# EAGLE design elosztó (EAGLE 6.5.0)
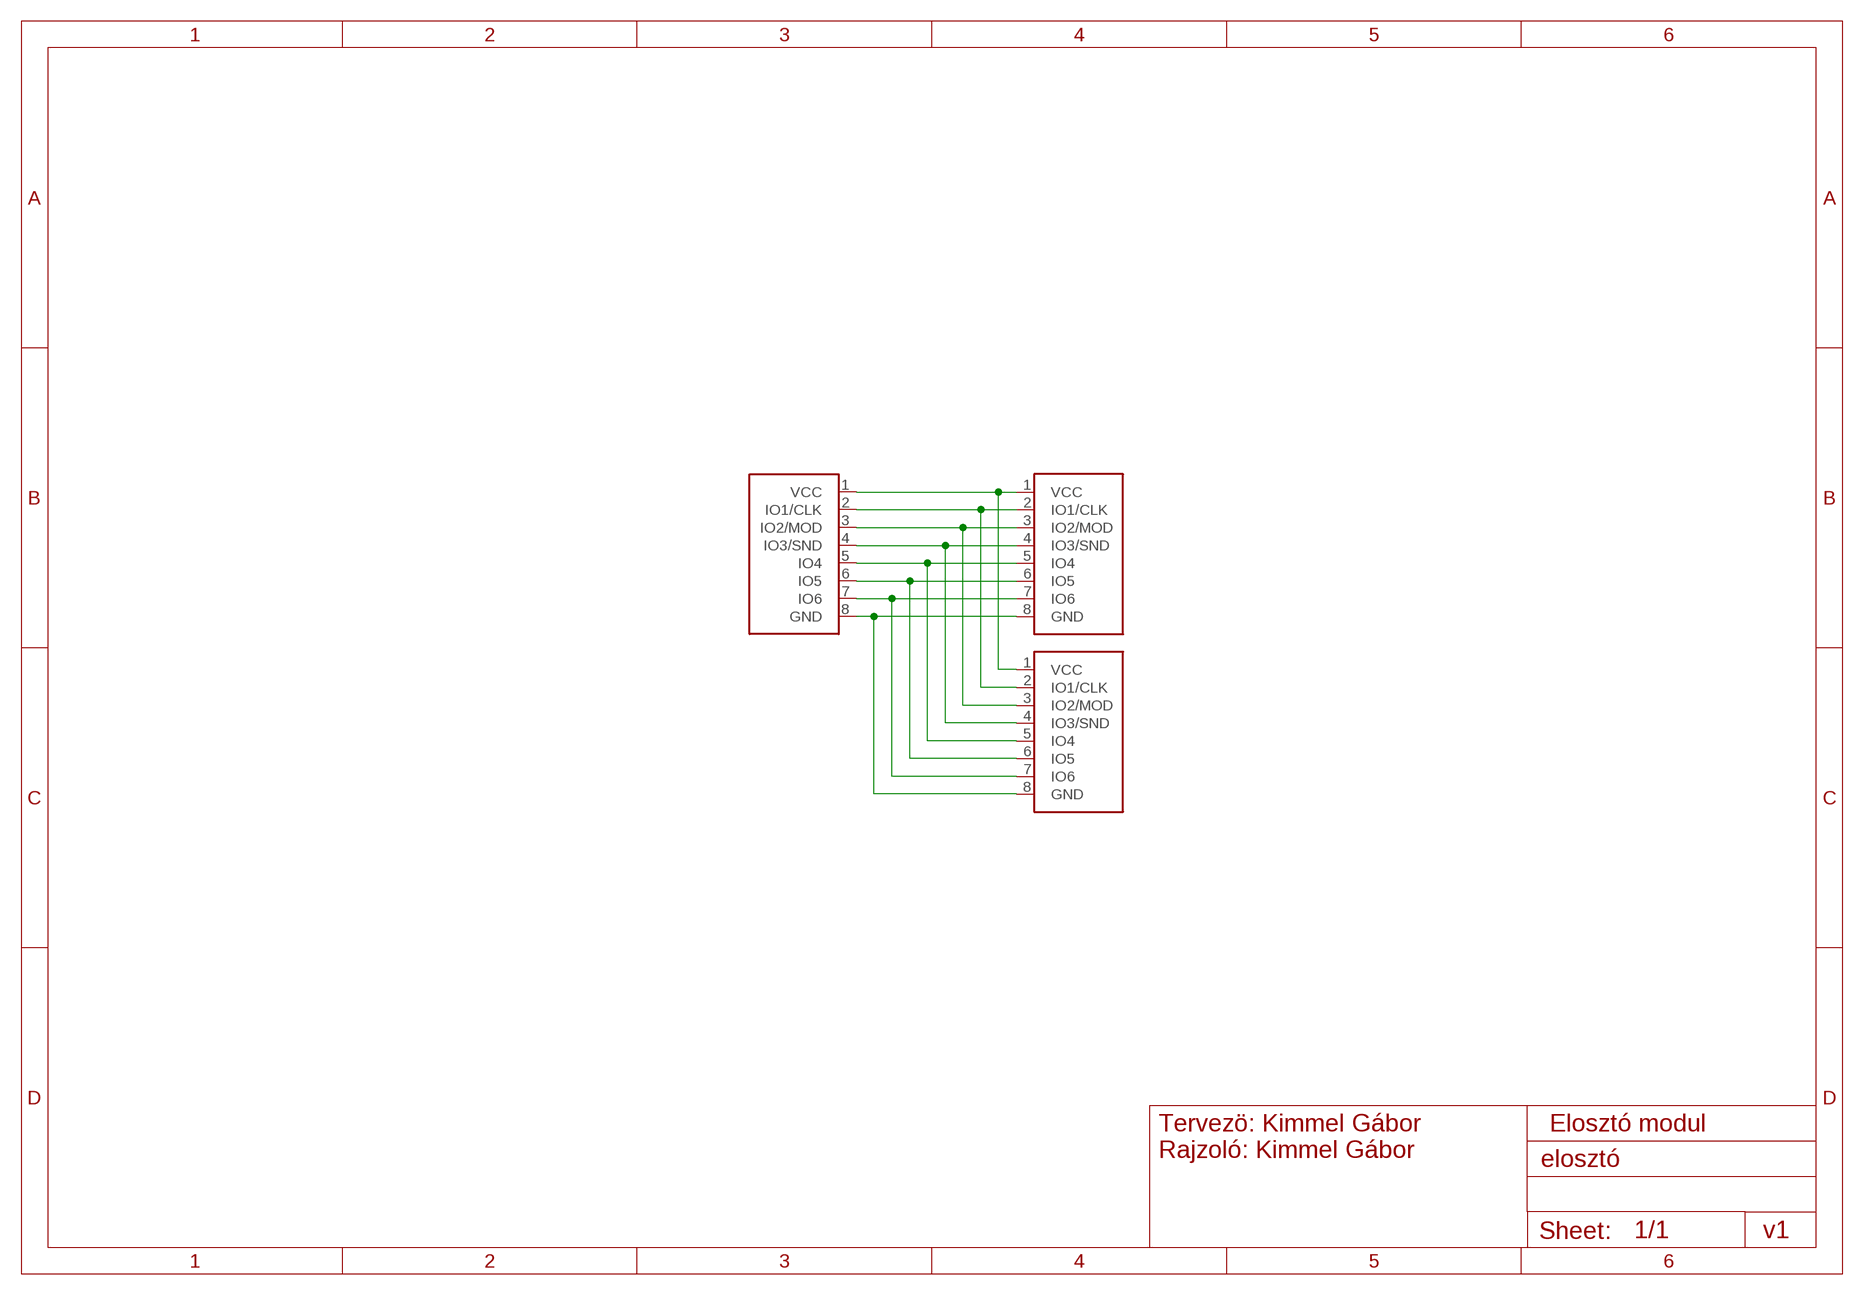
[diagram p0: schematic, sheet 1]

## Parts
U$1  GANZ-CONNECTOR  [FE08W]
U$2  GANZ-CONNECTOR-OUT  [MA08-1W]
U$3  GANZ-CONNECTOR-OUT  [MA08-1W]

## Nets
N$1: U$1.1(VCC) U$2.1(VCC) U$3.1(VCC)
N$2: U$1.2(IO1/CLK) U$2.2(IO1/CLK) U$3.2(IO1/CLK)
N$3: U$1.3(IO2/MOD) U$2.3(IO2/MOD) U$3.3(IO2/MOD)
N$4: U$1.4(IO3/SND) U$2.4(IO3/SND) U$3.4(IO3/SND)
N$5: U$1.5(IO4) U$2.5(IO4) U$3.5(IO4)
N$6: U$1.6(IO5) U$2.6(IO5) U$3.6(IO5)
N$7: U$1.7(IO6) U$2.7(IO6) U$3.7(IO6)
N$9: U$1.8(GND) U$2.8(GND) U$3.8(GND)

## Notes on the sheet
- Tervezö: Kimmel Gábor
  Rajzoló: Kimmel Gábor
- Elosztó modul
- v1

## Library data of the parts
U$1 = ganzlib:GANZ-CONNECTOR
U$2 U$3 = ganzlib:GANZ-CONNECTOR-OUT

## Board
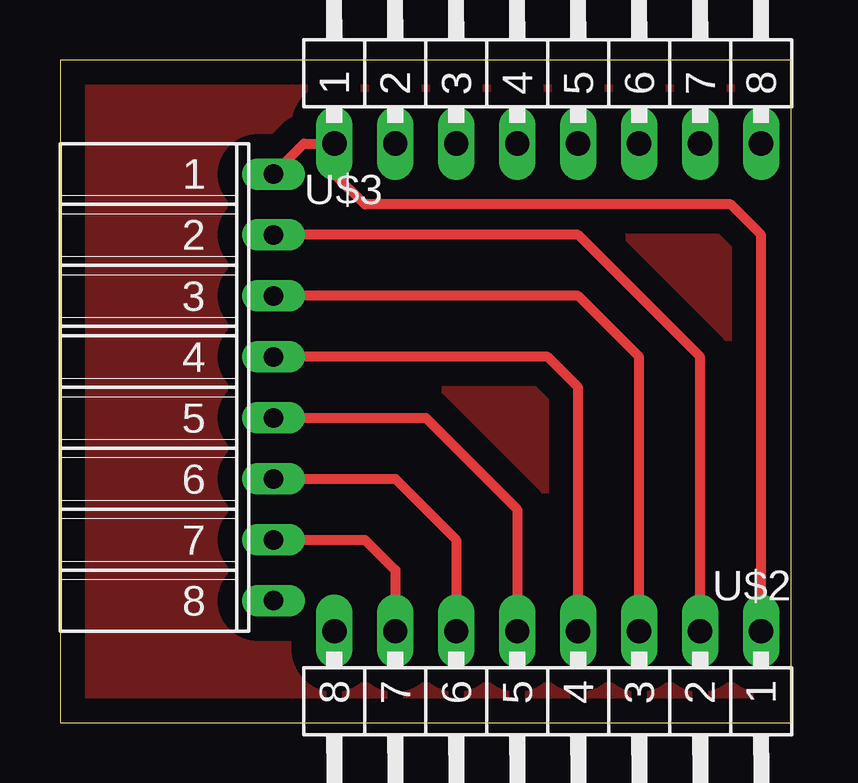
[diagram p1: board, top side]
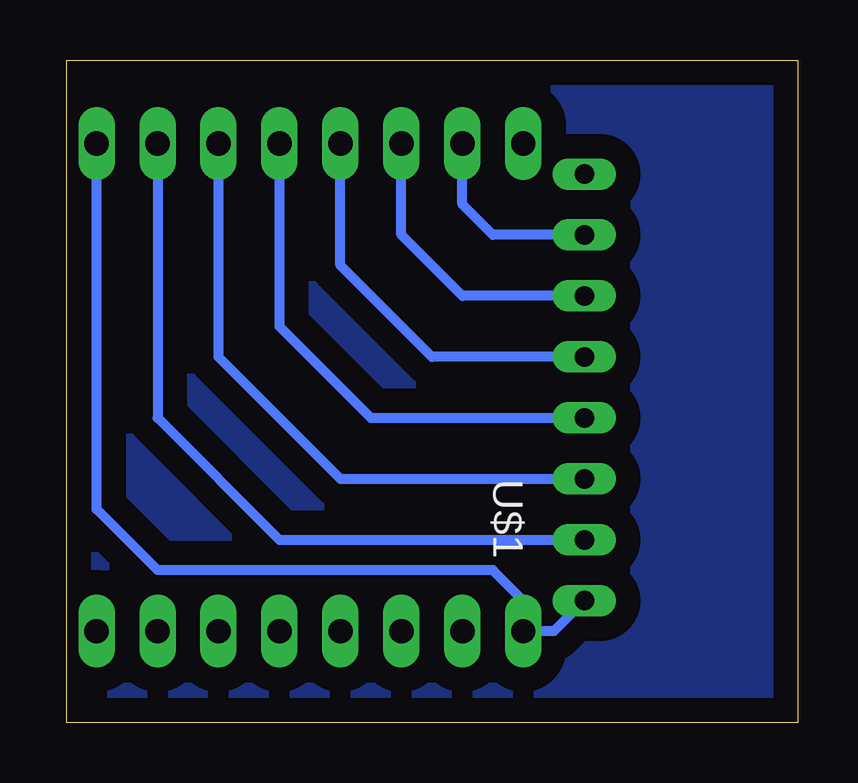
[diagram p2: board, bottom side, seen from below]

Size 30.46 x 27.61 mm. Coordinates in mm from the lower left corner, seen from the top.
Outline: 0,0 30.46,0 30.46,27.61 0,27.61 0,0
Copper layers (1*16): Top 0.035mm / dielectric 1.5mm / Bottom 0.035mm
Design rules "default": minimum track width 10mil, minimum drill 24mil, track to track 8mil, track to pad 8mil, pad to pad 8mil, via to via 8mil, smd to smd 8mil, copper to edge 40mil, drill to drill 8mil, minimum pad ring 10mil, minimum via ring 8mil, stop-mask expansion 4mil, vias tented up to drill 0mil, thermal gap 10mil

### Footprints (pad centres in the part's own frame; a part is rotated, then mirrored left to right if it is on the bottom)
FE08W = drill 0.813 long: 1 5.08,8.89; 2 5.08,6.35; 3 5.08,3.81; 4 5.08,1.27; 5 5.08,-1.27; 6 5.08,-3.81; 7 5.08,-6.35; 8 5.08,-8.89
MA08-1W = drill 1.016 long: 1 0,8.89; 2 0,6.35; 3 0,3.81; 4 0,1.27; 5 0,-1.27; 6 0,-3.81; 7 0,-6.35; 8 0,-8.89

### Placement (x,y rotation side)
U$1  3.81,13.97 0 top
U$2  20.32,3.81 270 top
U$3  20.32,24.13 90 top

### Tracks (layer width: path | path; a pad name or v marks a point on that pad's centre or on a via)
N$1
  Top 0.406: U$2.1 29.21,20.32 27.94,21.59 12.7,21.59 11.43,22.86 U$3.1 10.16,24.13 U$1.1
N$2
  Top 0.406: U$2.2 26.67,15.24 21.59,20.32 U$1.2
  Bottom 0.406: U$1.2 12.7,20.32 13.97,21.59 U$3.2
N$3
  Top 0.406: U$2.3 24.13,15.24 21.59,17.78 U$1.3
  Bottom 0.406: U$1.3 13.97,17.78 16.51,20.32 U$3.3
N$4
  Top 0.406: U$2.4 21.59,13.97 20.32,15.24 U$1.4
  Bottom 0.406: U$1.4 15.24,15.24 19.05,19.05 U$3.4
N$5
  Top 0.406: U$1.5 15.24,12.7 19.05,8.89 U$2.5
  Bottom 0.406: U$3.5 21.59,16.51 17.78,12.7 U$1.5
N$6
  Top 0.406: U$1.6 13.97,10.16 16.51,7.62 U$2.6
  Bottom 0.406: U$3.6 24.13,15.24 19.05,10.16 U$1.6
N$7
  Top 0.406: U$1.7 12.7,7.62 13.97,6.35 U$2.7
  Bottom 0.406: U$3.7 26.67,12.7 21.59,7.62 U$1.7
N$8
  pour Top (isolate 1.016): 0,27.94 30.48,27.94 30.48,0 0,0
N$9
  Bottom 0.406: U$1.8 10.16,3.81 U$2.8 11.43,5.08 12.7,6.35 26.67,6.35 29.21,8.89 U$3.8
N$10
  pour Bottom (isolate 1.016): 0,27.94 30.48,27.94 30.48,0 0,0